# Altium schematic sheet D1.SchDoc
size A; SheetNumber: 1; SheetTotal: 1
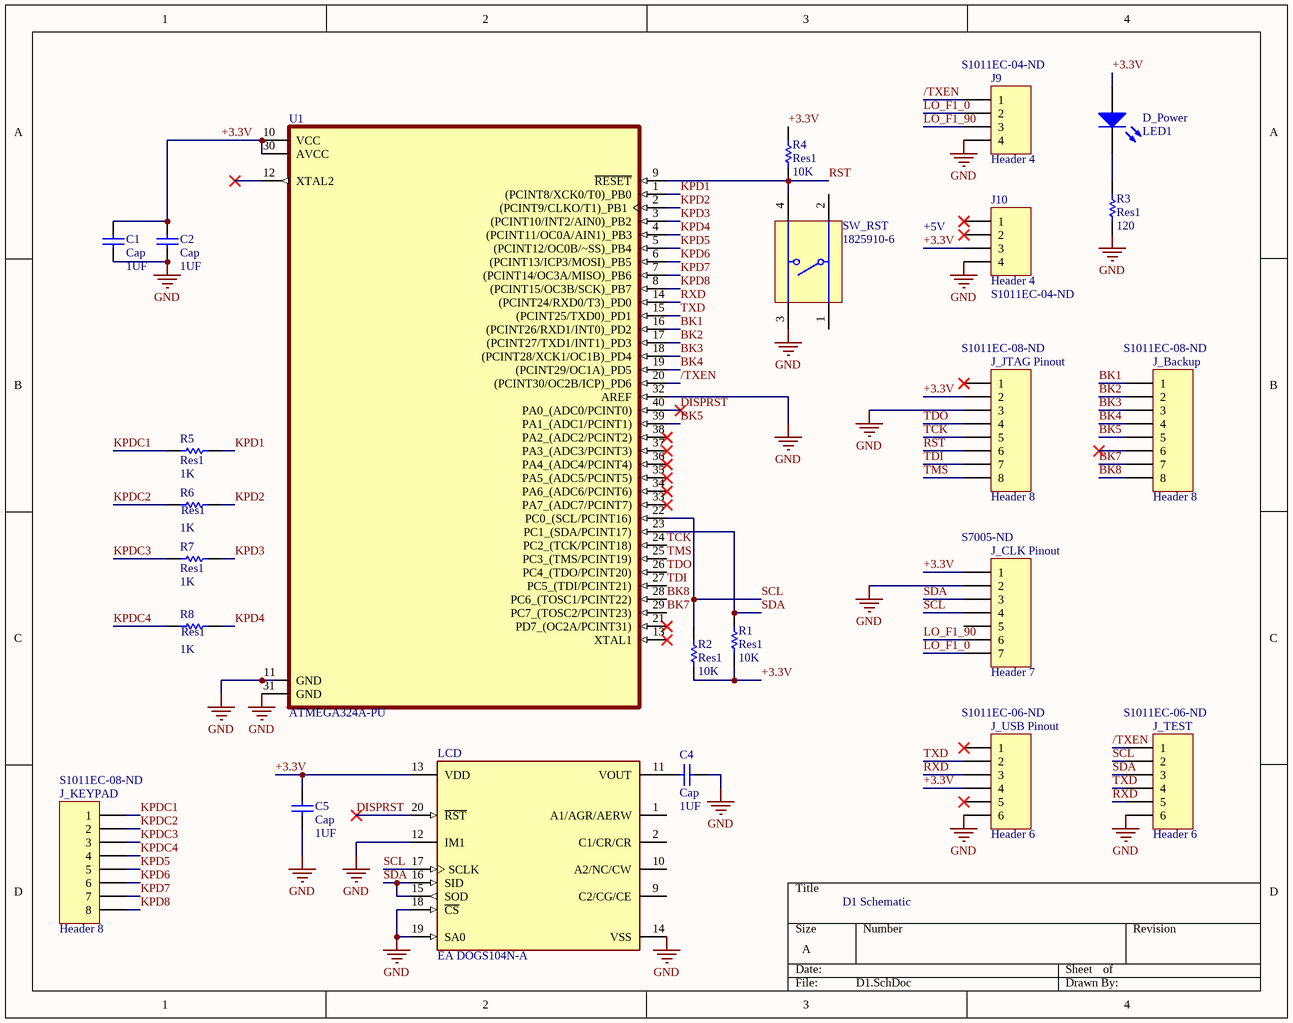
[diagram p0: D1.SchDoc]

## Parts
C1  Cap  value 1UF  [RADIAL-0.1]
C2  Cap  value 1UF  [RADIAL-0.1]
C4  Cap  value 1UF  [RADIAL-0.1]
C5  Cap  value 1UF  [RADIAL-0.1]
D_Power  LED1  [LED-1]
J9  Header 4  Supplier Part Number 1: S1011EC-04-ND  [HDR1X4]
J10  Header 4  Supplier Part Number 1: S1011EC-04-ND  [HDR1X4]
J_Backup  Header 8  Supplier Part Number 1: S1011EC-08-ND  [HDR1X8]
J_CLK_Pinout  Header 7  Supplier Part Number 1: S7005-ND  [HDR1X7]
J_JTAG_Pinout  Header 8  Supplier Part Number 1: S1011EC-08-ND  [HDR1X8]
J_KEYPAD  Header 8  Supplier Part Number 1: S1011EC-08-ND  [HDR1X8]
J_TEST  Header 6  Supplier Part Number 1: S1011EC-06-ND  [HDR1X6]
J_USB_Pinout  Header 6  Supplier Part Number 1: S1011EC-06-ND  [HDR1X6]
LCD  EA DOGS104N-A  [FP-EA_DOGS104N-A-MFG]
R1  Res1  value 10K  [AXIAL-0.1-RES]
R2  Res1  value 10K  [AXIAL-0.1-RES]
R3  Res1  value 120  [AXIAL-0.1-RES]
R4  Res1  value 10K  [AXIAL-0.1-RES]
R5  Res1  value 1K  [AXIAL-0.1-RES]
R6  Res1  value 1K  [AXIAL-0.1-RES]
R7  Res1  value 1K  [AXIAL-0.1-RES]
R8  Res1  value 1K  [AXIAL-0.1-RES]
SW_RST  1825910-6  [TECO-1825910-6_V]
U1  ATMEGA324A-PU  [40-DIP (0.600", 15.24mm)]

## Nets
GND: C1.2 C2.2 C4.2 C5.1 J9.4 J10.4 J_CLK_Pinout.2 J_JTAG_Pinout.3 J_TEST.6 J_USB_Pinout.6 LCD.12(IM1) LCD.14(VSS) LCD.18(~{CS}) LCD.19(SA0) R3.1 SW_RST.3 U1.11(GND) U1.31(GND) U1.32(AREF)
+3.3V: C1.1 C2.1 C5.2 D_Power.1(A) J10.3 J_CLK_Pinout.1 J_JTAG_Pinout.2 J_USB_Pinout.4 LCD.13(VDD) R1.1 R2.1 R4.1 U1.10(VCC) U1.30(AVCC)
/TXEN: J9.1 J_TEST.1 U1.20((PCINT30/OC2B/ICP)_PD6)
BK1: J_Backup.1 U1.16((PCINT26/RXD1/INT0)_PD2)
BK2: J_Backup.2 U1.17((PCINT27/TXD1/INT1)_PD3)
BK3: J_Backup.3 U1.18((PCINT28/XCK1/OC1B)_PD4)
BK4: J_Backup.4 U1.19((PCINT29/OC1A)_PD5)
BK5: J_Backup.5 U1.39(PA1_(ADC1/PCINT1))
BK7: J_Backup.7 U1.29(PC7_(TOSC2/PCINT23))
BK8: J_Backup.8 U1.28(PC6_(TOSC1/PCINT22))
DISPRST: LCD.20(~{RST}) U1.40(PA0_(ADC0/PCINT0))
KPD1: R5.2 U1.1((PCINT8/XCK0/T0)_PB0)
KPD2: R6.2 U1.2((PCINT9/CLKO/T1)_PB1)
KPD3: R7.2 U1.3((PCINT10/INT2/AIN0)_PB2)
KPD4: R8.2 U1.4((PCINT11/OC0A/AIN1)_PB3)
KPD5: J_KEYPAD.5 U1.5((PCINT12/OC0B/~SS)_PB4)
KPD6: J_KEYPAD.6 U1.6((PCINT13/ICP3/MOSI)_PB5)
KPD7: J_KEYPAD.7 U1.7((PCINT14/OC3A/MISO)_PB6)
KPD8: J_KEYPAD.8 U1.8((PCINT15/OC3B/SCK)_PB7)
KPDC1: J_KEYPAD.1 R5.1
KPDC2: J_KEYPAD.2 R6.1
KPDC3: J_KEYPAD.3 R7.1
KPDC4: J_KEYPAD.4 R8.1
LO_F1_0: J9.2 J_CLK_Pinout.7
LO_F1_90: J9.3 J_CLK_Pinout.6
RST: J_JTAG_Pinout.6 R4.2 SW_RST.4 U1.9(~{RESET})
RXD: J_TEST.5 J_USB_Pinout.3 U1.14((PCINT24/RXD0/T3)_PD0)
SCL: J_CLK_Pinout.4 J_TEST.2 LCD.17(SCLK) R2.2 U1.22(PC0_(SCL/PCINT16))
SDA: J_CLK_Pinout.3 J_TEST.3 LCD.15(SOD) LCD.16(SID) R1.2 U1.23(PC1_(SDA/PCINT17))
TCK: J_JTAG_Pinout.5 U1.24(PC2_(TCK/PCINT18))
TDI: J_JTAG_Pinout.7 U1.27(PC5_(TDI/PCINT21))
TDO: J_JTAG_Pinout.4 U1.26(PC4_(TDO/PCINT20))
TMS: J_JTAG_Pinout.8 U1.25(PC3_(TMS/PCINT19))
TXD: J_TEST.4 J_USB_Pinout.2 U1.15((PCINT25/TXD0)_PD1)
NetC4_1: C4.1 LCD.11(VOUT)
NetD_Power_2: D_Power.2(K) R3.2

Not connected (* = marked no-connect by the designer): J10 1* 2*; J_Backup 6*; J_CLK_Pinout 5; J_JTAG_Pinout 1*; J_USB_Pinout 1* 5*; LCD 1(A1/AGR/AERW) 2(C1/CR/CR) 9(C2/CG/CE) 10(A2/NC/CW); SW_RST 1 2; U1 12(XTAL2)* 13(XTAL1)* 21(PD7_(OC2A/PCINT31))* 33(PA7_(ADC7/PCINT7))* 34(PA6_(ADC6/PCINT6))* 35(PA5_(ADC5/PCINT5))* 36(PA4_(ADC4/PCINT4))* 37(PA3_(ADC3/PCINT3))* 38(PA2_(ADC2/PCINT2))*

## Notes on the sheet
- (near J10) +5V
- D1 Schematic

## Library data of the parts
C1 C2 C4 C5 = CAP CER 1UF 50V X7R RADIAL: Capacitor; Manufacturer Part Number: C333C105K5R5TA7301; Designator: C?; Voltage Rating: 50V; Published: 8-Jun-2000; LatestRevisionDate: 17-Jul-2002; LatestRevisionNote: Re-released for DXP Platform.; Publisher: Altium Limited
D_Power = LED1: Typical RED GaAs LED; Published: 8-Jun-2000; LatestRevisionDate: 08-Jul-2005; LatestRevisionNote: Mech Layer 1 removed.; PackageReference: LED-1; Publisher: Altium Limited; PackageDescription: LED; 2 Leads
J9 J10 = Header 4: Conn Header Vert 4POS 2.54MM; Manufacturer: Sullins; Manufacturer Part Number: PRPC004SAAN-RC; Number of Positions: 4; Connector Type: Male Pin; Pitch: 0.1inch; LatestRevisionDate: 17-Jul-2002; LatestRevisionNote: Re-released for DXP Platform.; Publisher: Altium Limited; Supplier 1: Digi-Key; RoHS: Yes; Category: Connectors; Stock 1: 11663; Pricing 1: 1=0.15000, 10=0.14600, 25=0.10840, 50=0.09280, 100=0.08980, 250=0.07740, 500=0.07430 (USD); Mount: Through Hole; Color: Black; Contact Plating: Gold; Package Quantity: 1; Number of Rows: 1; Packaging: Bulk; Termination: Solder; Series: -; Contact Type: Male Pin; Contact Mating Length: 0.23inch; RoHS Compliant: Yes; ComponentLink1URL: https://datasheet.ciiva.com/741/xrxczzzsxxn-rc-st-11635-b-741241.pdf?src-supplier=Digi-Key; ComponentLink1Description: https://datasheet.ciiva.com/741/xrxczzzsxxn-rc-st-11635-b-741241.pdf?src-supplier=Digi-Key
J_Backup J_JTAG_Pinout J_KEYPAD = Header 8: Conn Header Vert 8POS 2.54MM; Manufacturer: Sullins; Manufacturer Part Number: PRPC008SAAN-RC; Number of Positions: 8; Connector Type: Male Pin; Pitch: 0.1inch; LatestRevisionDate: 17-Jul-2002; LatestRevisionNote: Re-released for DXP Platform.; Publisher: Altium Limited; Supplier 1: Digi-Key; RoHS: Yes; Category: Connectors; Pricing 1: 1=0.25000, 10=0.23200, 25=0.19800, 50=0.17340, 100=0.16100, 250=0.14240, 500=0.13622 (USD); Mount: Through Hole; Color: Black; Contact Plating: Gold; Package Quantity: 1; Number of Rows: 1; Packaging: Bulk; Termination: Solder; Series: -; Contact Type: Male Pin; Contact Mating Length: 0.23inch; Lead Free: Lead Free; RoHS Compliant: Yes; ComponentLink1URL: https://datasheet.ciiva.com/741/xrxczzzsxxn-rc-st-11635-b-741237.pdf?src-supplier=Digi-Key; ComponentLink1Description: https://datasheet.ciiva.com/741/xrxczzzsxxn-rc-st-11635-b-741237.pdf?src-supplier=Digi-Key
  J_Backup: Stock 1: 4475
  J_JTAG_Pinout: Stock 1: 5110
  J_KEYPAD: Stock 1: 4930
J_CLK_Pinout = Header 7: Female, 7C, Straight, .100"CC; 3.20mm Tail, No Mt. 100u" Tin; PBT, Phos Bronze, 105 C; Manufacturer: Sullins; Manufacturer Part Number: PPTC071LFBN-RC; Number of Positions: 7; Pitch: 0.1inch; LatestRevisionDate: 17-Jul-2002; LatestRevisionNote: Re-released for DXP Platform.; Publisher: Altium Limited; Supplier 1: Digi-Key; RoHS: Yes; Category: Connectors; Stock 1: 31167; Pricing 1: 1=0.59000, 10=0.51500, 80=0.42438, 440=0.36900, 1000=0.30442, 5000=0.26752, 10000=0.26650 (USD); Mount: Through Hole; Color: Black; Contact Plating: Tin; Contact Material: Bronze; Housing Material: Plastic; Package Quantity: 1000; Number of Rows: 1; Packaging: Bulk; Termination: Solder; Connector Type: Header; Contact Type: Female Socket; Length: 18.3mm; Width: 2.5mm; Height: 8.5mm; Lead Free: Lead Free; ComponentLink1URL: https://media.digikey.com/pdf/Data%20Sheets/Sullins%20PDFs/Female_Headers.100_DS.pdf?src-supplier=Digi-Key; ComponentLink1Description: https://media.digikey.com/pdf/Data%20Sheets/Sullins%20PDFs/Female_Headers.100_DS.pdf?src-supplier=Digi-Key; ComponentLink2URL: http://www.sullinscorp.com/catalogs/78_Page80-81_HEADER_.100_2.54mm_FEMALE.pdf?src-supplier=Future+Electronics; ComponentLink2Description: http://www.sullinscorp.com/catalogs/78_Page80-81_HEADER_.100_2.54mm_FEMALE.pdf?src-supplier=Future+Electronics
J_TEST J_USB_Pinout = Header 6: Conn Header .100" Sngl Str 6POS; Manufacturer: Sullins; Manufacturer Part Number: PRPC006SAAN-RC; Number of Positions: 6; Connector Type: Male Pin; Pitch: 0.1inch; LatestRevisionDate: 17-Jul-2002; LatestRevisionNote: Re-released for DXP Platform.; Publisher: Altium Limited; Supplier 1: Digi-Key; RoHS: Yes; Category: Connectors; Pricing 1: 1=0.19000, 10=0.17400, 25=0.14880, 50=0.13000, 100=0.12070, 250=0.10680, 500=0.10216 (USD); Mount: Through Hole; Color: Black; Contact Plating: Gold; Package Quantity: 1; Number of Rows: 1; Packaging: Bulk; Termination: Solder; Series: -; Contact Type: Male Pin; Contact Mating Length: 0.23inch; Lead Free: Lead Free; RoHS Compliant: Yes; ComponentLink1URL: https://datasheet.ciiva.com/741/xrxczzzsxxn-rc-st-11635-b-741239.pdf?src-supplier=Digi-Key; ComponentLink1Description: https://datasheet.ciiva.com/741/xrxczzzsxxn-rc-st-11635-b-741239.pdf?src-supplier=Digi-Key
  J_TEST: Stock 1: 12344
  J_USB_Pinout: Stock 1: 14553
LCD = CMP-140401-000002-2: LCD MOD 40DIG 10X4 TRANSFLECTIVE; Manufacturer: Display Visions; Interface: I2C,SPI; Viewing Angle: 180°; Standoff Height: 1.5mm; Number Of Characters: 40; ComponentLink2Description: Datasheet; Height: 4.6mm; Temperature: -20°C to +70°C; Category: Disp; Package: 0; RoHS: TRUE; Lead Free: Yes; Temperature Range Low: -20°C; Manufacturer Part Number: EA DOGS104N-A; Device Class L3: LCD; Display Type: LCD; Automotive: No; Colour: White; Octopart: https://octopart.com/ea+dogs104n-a-display+visions-99339937; Digikey Description: LCD MOD 40DIG 10X4 TRANSFLECTIVE; ComponentLink2URL: https://www.lcd-module.de/fileadmin/html-seiten/eng/pdf/doma/dogs104e.pdf; Device Class L1: Optoelectronics; Temperature Range High: +70°C; Device Class L2: Displays
R1 R2 R4 = RES 10K OHM 5% 1/4W AXIAL: Resistor; Manufacturer Part Number: CFR-25JB-52-10K; Designator: R?; Power Rating: 1/4W; Tolerance: 0.05; Published: 8-Jun-2000; LatestRevisionDate: 17-Jul-2002; LatestRevisionNote: Re-released for DXP Platform.; Publisher: Altium Limited
R3 = RES 120 OHM 5% 1/4W AXIAL: Resistor; Manufacturer Part Number: CFR-25JB-52-120R; Designator: R?; Power Rating: 1/4W; Tolerance: 0.05; Published: 8-Jun-2000; LatestRevisionDate: 17-Jul-2002; LatestRevisionNote: Re-released for DXP Platform.; Publisher: Altium Limited
R5-R8 = RES 1K OHM 5% 1/4W AXIAL: Resistor; Manufacturer Part Number: CFR-25JB-52-1K; Designator: R?; Power Rating: 1/4W; Tolerance: 0.05; Published: 8-Jun-2000; LatestRevisionDate: 17-Jul-2002; LatestRevisionNote: Re-released for DXP Platform.; Publisher: Altium Limited
SW_RST = CMP-1684-00021-1: Tact Switch, SPST-NO, 0.05 A, -35 to 85 degC, 4-Pin THD, RoHS, Bulk; Manufacturer: TE Connectivity; Maximum Contact Resistance: 100mOhm; Mechanical Life: 100000Cycles; Bushing Type: Unthreaded; Switch Configuration: OFF(ON); Maximum DC Voltage Rating: 24V; Contact Rating @ Voltage: 0.05A@24VDC; Actuator Color: Black; Body Orientation: Straight; Function: MomentaryContact; Illumination: N/R; Actuator Style: RoundButton; Actuator Material: PolybutyleneTerephthalate; Dielectric Strength: 500VAC; Pole Throw Configuration: SPST; Actuator Length: 1.4mm; Product Weight: N/A; Contact Material: CopperAlloy; Housing Material: N/A; Terminal Type: PCPins; Minimum Insulation Resistance: 100MOhm; Package Description: 4-Pin Through Hole Device, Body 5.99 x 5.99 mm, Pitch 6.5 mm; Part No: 1825910-6; Package Reference: THD; Base Material: N/A; Manufacturer URL: http://www.te.com; Contact Plating: Silver; RoHS: Yes; Datasheet Version: Rev. C9; Electrical Life: 100000Cycles; Maximum AC Voltage Rating: N/A; Thread Size: N/R; Operating Temperature: -35to85C; Mounting: ThroughHole; Dimension: 5.99x5mm; Datasheet URL: http://www.te.com/commerce/DocumentDelivery/DDEController?Action=showdoc&DocId=Customer+Drawing%7F1825910%7FC9%7Fpdf%7FEnglish%7FENG_CD_1825910_C9.pdf%7F1825910-6; Family: 1825910; Seal Location: N/A; Seal Description: N/A; Packaging: N/A
U1 = ATMEGA324A-PU: AVR series Microcontroller IC 8-Bit 20MHz 32KB (16K x 16) FLASH 40-PDIP; MF: Microchip Technology; Designator: U?; Package: PDIP-40 Microchip; SnapEDA_Link: https://www.snapeda.com/parts/ATMEGA324A-PU/Microchip/view-part/?ref=snap; Value: *; MP: ATMEGA324A-PU; Availability: In Stock; Price: None; Purchase-URL: https://pricing.snapeda.com/search/part/ATMEGA324A-PU/?ref=eda; Check_prices: https://www.snapeda.com/parts/ATMEGA324A-PU/Microchip/view-part/?ref=eda; Manufacturer Part Number: ATMEGA324A-PU